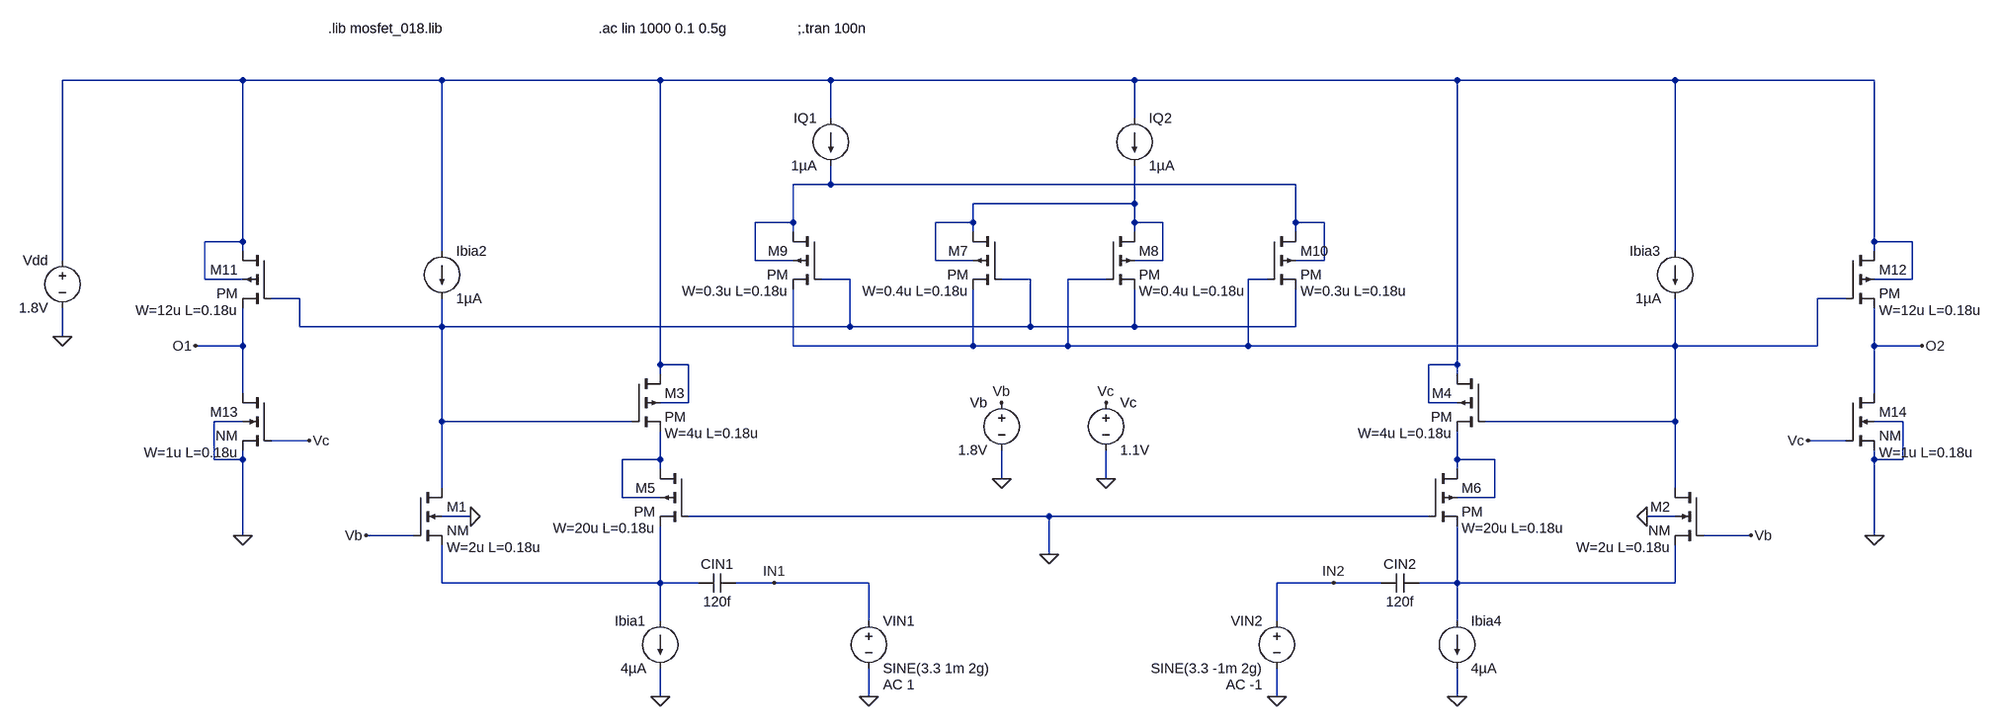
[diagram p0: schematic cmos_bandpass_filter.asc]
cmos_bandpass_filter.asc, the LTspice schematic file:
Version 4
SHEET 1 2824 1108
WIRE -128 16 -432 16
WIRE 208 16 -128 16
WIRE 576 16 208 16
WIRE 864 16 576 16
WIRE 1376 16 864 16
WIRE 1920 16 1376 16
WIRE 2288 16 1920 16
WIRE 2624 16 2288 16
WIRE 864 80 864 16
WIRE 1376 80 1376 16
WIRE 864 192 864 160
WIRE 864 192 800 192
WIRE 1648 192 864 192
WIRE 1376 224 1376 160
WIRE 1376 224 1104 224
WIRE 800 256 800 192
WIRE 800 256 736 256
WIRE 1104 256 1104 224
WIRE 1104 256 1040 256
WIRE 1376 256 1376 224
WIRE 1424 256 1376 256
WIRE 1648 256 1648 192
WIRE 1696 256 1648 256
WIRE 800 272 800 256
WIRE 1104 272 1104 256
WIRE 1376 272 1376 256
WIRE 1648 272 1648 256
WIRE -128 288 -128 16
WIRE -128 288 -192 288
WIRE 2624 288 2624 16
WIRE 2688 288 2624 288
WIRE -128 304 -128 288
WIRE 208 304 208 16
WIRE 2288 304 2288 16
WIRE 2624 304 2624 288
WIRE -432 320 -432 16
WIRE 736 320 736 256
WIRE 800 320 736 320
WIRE 1040 320 1040 256
WIRE 1104 320 1040 320
WIRE 1424 320 1424 256
WIRE 1424 320 1376 320
WIRE 1696 320 1696 256
WIRE 1696 320 1648 320
WIRE -192 352 -192 288
WIRE -128 352 -192 352
WIRE 896 352 848 352
WIRE 1200 352 1152 352
WIRE 1328 352 1264 352
WIRE 1600 352 1568 352
WIRE 2688 352 2688 288
WIRE 2688 352 2624 352
WIRE -32 384 -80 384
WIRE 2576 384 2528 384
WIRE -32 432 -32 384
WIRE 208 432 208 384
WIRE 208 432 -32 432
WIRE 896 432 896 352
WIRE 896 432 208 432
WIRE 1200 432 1200 352
WIRE 1200 432 896 432
WIRE 1376 432 1376 368
WIRE 1376 432 1200 432
WIRE 1648 432 1648 368
WIRE 1648 432 1376 432
WIRE -432 448 -432 400
WIRE -128 464 -128 400
WIRE -128 464 -208 464
WIRE 800 464 800 368
WIRE 1104 464 1104 368
WIRE 1104 464 800 464
WIRE 1264 464 1264 352
WIRE 1264 464 1104 464
WIRE 1568 464 1568 352
WIRE 1568 464 1264 464
WIRE 2288 464 2288 384
WIRE 2288 464 1568 464
WIRE 2528 464 2528 384
WIRE 2528 464 2288 464
WIRE 2624 464 2624 400
WIRE 2704 464 2624 464
WIRE 576 496 576 16
WIRE 624 496 576 496
WIRE 1920 496 1920 16
WIRE 1920 496 1872 496
WIRE 576 512 576 496
WIRE 1920 512 1920 496
WIRE -128 544 -128 464
WIRE 2624 544 2624 464
WIRE 624 560 624 496
WIRE 624 560 576 560
WIRE 1872 560 1872 496
WIRE 1920 560 1872 560
WIRE -128 592 -176 592
WIRE 208 592 208 432
WIRE 528 592 208 592
WIRE 2288 592 2288 464
WIRE 2288 592 1968 592
WIRE 2672 592 2624 592
WIRE -16 624 -80 624
WIRE 2576 624 2512 624
WIRE -176 656 -176 592
WIRE -128 656 -128 640
WIRE -128 656 -176 656
WIRE 576 656 576 608
WIRE 576 656 512 656
WIRE 1920 656 1920 608
WIRE 1984 656 1920 656
WIRE 2624 656 2624 640
WIRE 2672 656 2672 592
WIRE 2672 656 2624 656
WIRE 576 672 576 656
WIRE 1920 672 1920 656
WIRE 1152 688 1152 640
WIRE 1328 688 1328 640
WIRE 208 704 208 592
WIRE 2288 704 2288 592
WIRE 512 720 512 656
WIRE 576 720 512 720
WIRE 1984 720 1984 656
WIRE 1984 720 1920 720
WIRE 256 752 208 752
WIRE 1232 752 624 752
WIRE 1872 752 1232 752
WIRE 2288 752 2240 752
WIRE -128 784 -128 656
WIRE 160 784 80 784
WIRE 2416 784 2336 784
WIRE 2624 784 2624 656
WIRE 1232 816 1232 752
WIRE 208 864 208 800
WIRE 576 864 576 768
WIRE 576 864 208 864
WIRE 640 864 576 864
WIRE 768 864 704 864
WIRE 928 864 768 864
WIRE 1712 864 1616 864
WIRE 1792 864 1712 864
WIRE 1920 864 1920 768
WIRE 1920 864 1856 864
WIRE 2288 864 2288 800
WIRE 2288 864 1920 864
WIRE 576 928 576 864
WIRE 928 928 928 864
WIRE 1616 928 1616 864
WIRE 1920 928 1920 864
WIRE 576 1056 576 1008
WIRE 928 1056 928 1008
WIRE 1616 1056 1616 1008
WIRE 1920 1056 1920 1008
FLAG -128 784 0
FLAG 256 752 0
FLAG -432 448 0
FLAG -208 464 O1
FLAG -16 624 Vc
FLAG 80 784 Vb
FLAG 576 1056 0
FLAG 768 864 IN1
FLAG 1232 816 0
FLAG 2624 784 0
FLAG 2240 752 0
FLAG 2704 464 O2
FLAG 2512 624 Vc
FLAG 2416 784 Vb
FLAG 1920 1056 0
FLAG 1152 688 0
FLAG 1328 688 0
FLAG 1616 1056 0
FLAG 1152 560 Vb
FLAG 1328 560 Vc
FLAG 928 1056 0
FLAG 1712 864 IN2
SYMBOL pmos4 -80 304 M0
WINDOW 123 56 100 Left 2
SYMATTR Value2 W=12u L=0.18u
SYMATTR InstName M11
SYMATTR Value PM
SYMBOL nmos4 -80 544 M0
WINDOW 123 56 100 Left 2
SYMATTR Value2 W=1u L=0.18u
SYMATTR InstName M13
SYMATTR Value NM
SYMBOL nmos4 160 704 R0
WINDOW 123 56 100 Left 2
SYMATTR Value2 W=2u L=0.18u
SYMATTR InstName M1
SYMATTR Value NM
SYMBOL current 208 304 R0
SYMATTR InstName Ibia2
SYMATTR Value 1µA
SYMBOL voltage -432 304 M0
SYMATTR InstName Vdd
SYMATTR Value 1.8V
SYMBOL current 576 928 M0
WINDOW 123 0 0 Left 0
WINDOW 39 0 0 Left 0
SYMATTR InstName Ibia1
SYMATTR Value 4µA
SYMBOL pmos4 624 672 M0
WINDOW 123 56 100 Left 2
SYMATTR Value2 W=20u L=0.18u
SYMATTR InstName M5
SYMATTR Value PM
SYMBOL cap 704 848 R90
WINDOW 0 0 32 VBottom 2
WINDOW 3 32 32 VTop 2
SYMATTR InstName CIN1
SYMATTR Value 120f
SYMBOL pmos4 528 512 R0
WINDOW 123 56 100 Left 2
SYMATTR Value2 W=4u L=0.18u
SYMATTR InstName M3
SYMATTR Value PM
SYMBOL pmos4 848 272 M0
WINDOW 123 56 100 Left 2
SYMATTR Value2 W=0.3u L=0.18u
SYMATTR InstName M9
SYMATTR Value PM
SYMBOL current 864 80 M0
SYMATTR InstName IQ1
SYMATTR Value 1µA
SYMBOL pmos4 1152 272 M0
WINDOW 123 56 100 Left 2
SYMATTR Value2 W=0.4u L=0.18u
SYMATTR InstName M7
SYMATTR Value PM
SYMBOL current 1376 80 R0
SYMATTR InstName IQ2
SYMATTR Value 1µA
SYMBOL pmos4 1328 272 R0
WINDOW 123 56 100 Left 2
SYMATTR Value2 W=0.4u L=0.18u
SYMATTR InstName M8
SYMATTR Value PM
SYMBOL pmos4 1600 272 R0
WINDOW 123 56 100 Left 2
SYMATTR Value2 W=0.3u L=0.18u
SYMATTR InstName M10
SYMATTR Value PM
SYMBOL pmos4 2576 304 R0
WINDOW 123 56 100 Left 2
SYMATTR Value2 W=12u L=0.18u
SYMATTR InstName M12
SYMATTR Value PM
SYMBOL nmos4 2576 544 R0
WINDOW 123 56 100 Left 2
SYMATTR Value2 W=1u L=0.18u
SYMATTR InstName M14
SYMATTR Value NM
SYMBOL nmos4 2336 704 M0
WINDOW 123 56 100 Left 2
SYMATTR Value2 W=2u L=0.18u
SYMATTR InstName M2
SYMATTR Value NM
SYMBOL current 2288 304 M0
SYMATTR InstName Ibia3
SYMATTR Value 1µA
SYMBOL current 1920 928 R0
WINDOW 123 0 0 Left 0
WINDOW 39 0 0 Left 0
SYMATTR InstName Ibia4
SYMATTR Value 4µA
SYMBOL pmos4 1872 672 R0
WINDOW 123 56 100 Left 2
SYMATTR Value2 W=20u L=0.18u
SYMATTR InstName M6
SYMATTR Value PM
SYMBOL cap 1792 848 M90
WINDOW 0 0 32 VBottom 2
WINDOW 3 32 32 VTop 2
SYMATTR InstName CIN2
SYMATTR Value 120f
SYMBOL pmos4 1968 512 M0
WINDOW 123 56 100 Left 2
SYMATTR Value2 W=4u L=0.18u
SYMATTR InstName M4
SYMATTR Value PM
SYMBOL voltage 1152 544 M0
SYMATTR InstName Vb
SYMATTR Value 1.8V
SYMBOL voltage 1328 544 R0
SYMATTR InstName Vc
SYMATTR Value 1.1V
SYMBOL voltage 1616 912 M0
WINDOW 123 24 124 Left 2
WINDOW 39 0 0 Left 0
SYMATTR Value2 AC -1
SYMATTR InstName VIN2
SYMATTR Value SINE(3.3 -1m 2g)
SYMBOL voltage 928 912 R0
WINDOW 123 24 124 Left 2
WINDOW 39 0 0 Left 0
SYMATTR Value2 AC 1
SYMATTR InstName VIN1
SYMATTR Value SINE(3.3 1m 2g)
TEXT 16 -72 Left 2 !.lib mosfet_018.lib
TEXT 472 -72 Left 2 !.ac lin 1000 0.1 0.5g
TEXT 808 -72 Left 2 !;.tran 100n

The netlist it stands for:
* cmos_bandpass_filter.asc
M11 N001 N004 O1 N001 PM W=12u L=0.18u
M13 O1 Vc 0 0 NM W=1u L=0.18u
M1 N004 Vb N008 0 NM W=2u L=0.18u
Ibia2 N001 N004 1µA
Vdd N001 0 1.8V
Ibia1 N008 0 4µA
M5 N006 0 N008 N006 PM W=20u L=0.18u
CIN1 IN1 N008 120f
M3 N001 N004 N006 N001 PM W=4u L=0.18u
M9 N002 N004 N005 N002 PM W=0.3u L=0.18u
IQ1 N001 N002 1µA
M7 N003 N004 N005 N003 PM W=0.4u L=0.18u
IQ2 N001 N003 1µA
M8 N003 N005 N004 N003 PM W=0.4u L=0.18u
M10 N002 N005 N004 N002 PM W=0.3u L=0.18u
M12 N001 N005 O2 N001 PM W=12u L=0.18u
M14 O2 Vc 0 0 NM W=1u L=0.18u
M2 N005 Vb N009 0 NM W=2u L=0.18u
Ibia3 N001 N005 1µA
Ibia4 N009 0 4µA
M6 N007 0 N009 N007 PM W=20u L=0.18u
CIN2 IN2 N009 120f
M4 N001 N005 N007 N001 PM W=4u L=0.18u
Vb Vb 0 1.8V
Vc Vc 0 1.1V
VIN2 IN2 0 SINE(3.3 -1m 2g) AC -1
VIN1 IN1 0 SINE(3.3 1m 2g) AC 1
.model NMOS NMOS
.model PMOS PMOS
.lib standard.mos
.lib mosfet_018.lib
.ac lin 1000 0.1 0.5g
;.tran 100n
.backanno
.end